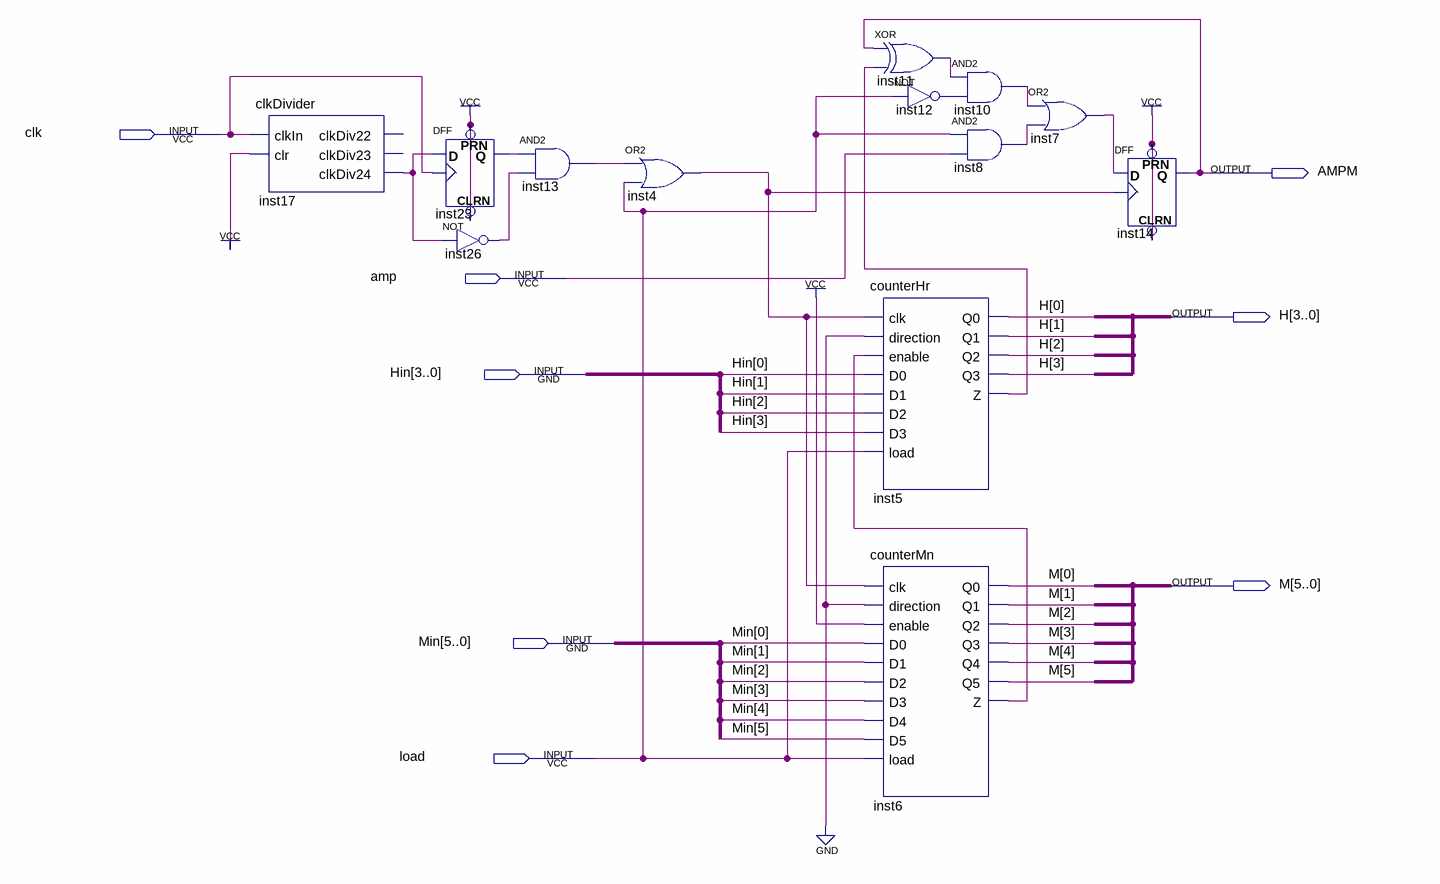
[diagram p0: schematic sheet]
// Quartus schematic mainClock.bdf as structural Verilog: 13 symbols, 8 pins
module mainClock (
  input  clk,
  input  amp,
  input  [3:0] Hin,
  input  [5:0] Min,
  input  load,
  output AMPM,
  output [3:0] H,
  output [5:0] M
);

  wire inst4_out, inst5_z, inst6_z, inst7_out, inst8_out, inst10_out, inst11_out, inst12_out, inst13_out,
       inst17_clkdiv24, inst23_q, inst26_out;

  clkDivider inst17 (.clkIn(clk), .clr(1'b1), .clkDiv24(inst17_clkdiv24));  // open: clkDiv22, clkDiv23
  DFF inst23 (.CLRN(1'b1), .CLK(clk), .D(inst17_clkdiv24), .PRN(1'b1), .Q(inst23_q));
  not inst26 (inst26_out, inst17_clkdiv24);
  and inst13 (inst13_out, inst23_q, inst26_out);
  or inst4 (inst4_out, inst13_out, load);
  xor inst11 (inst11_out, AMPM, inst5_z);
  not inst12 (inst12_out, load);
  counterHr inst5 (
    .clk(inst4_out), .direction(1'b0), .enable(inst6_z), .D0(Hin[0]), .D1(Hin[1]), .D2(Hin[2]), .D3(Hin[3]),
    .load(load), .Q0(H[0]), .Q1(H[1]), .Q2(H[2]), .Q3(H[3]), .Z(inst5_z));
  counterMn inst6 (
    .clk(inst4_out), .direction(1'b0), .enable(1'b1), .D0(Min[0]), .D1(Min[1]), .D2(Min[2]), .D3(Min[3]),
    .D4(Min[4]), .D5(Min[5]), .load(load), .Q0(M[0]), .Q1(M[1]), .Q2(M[2]), .Q3(M[3]), .Q4(M[4]), .Q5(M[5]),
    .Z(inst6_z));
  and inst10 (inst10_out, inst11_out, inst12_out);
  and inst8 (inst8_out, load, amp);
  or inst7 (inst7_out, inst10_out, inst8_out);
  DFF inst14 (.CLRN(1'b1), .CLK(inst4_out), .D(inst7_out), .PRN(1'b1), .Q(AMPM));
endmodule
